# Altium schematic sheet Sheet1.SchDoc
size A
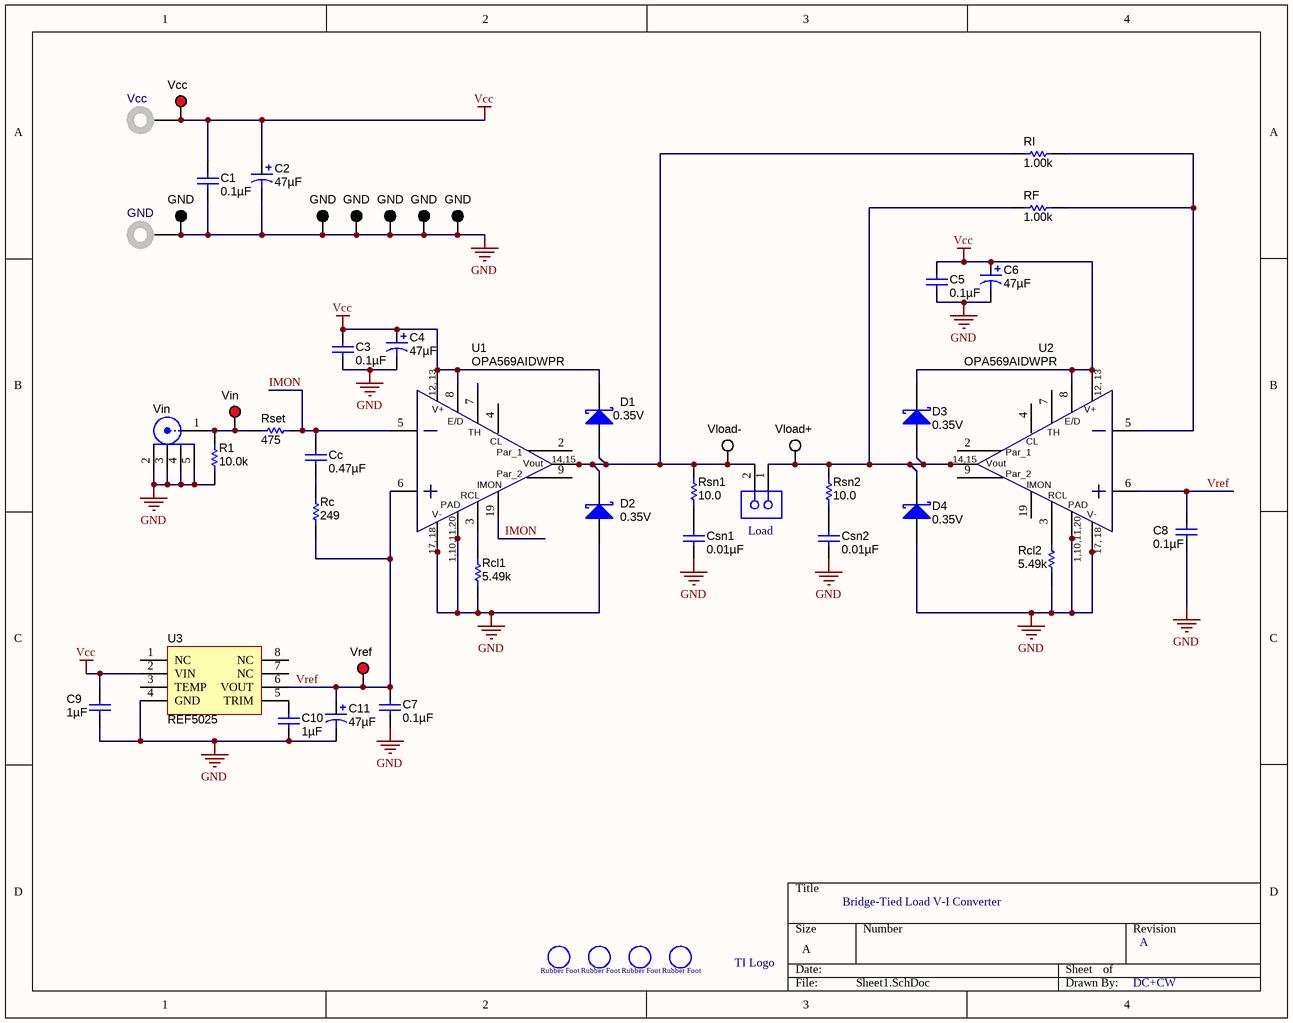
[diagram p0: Sheet1.SchDoc]

## Parts
C1  ValueDisplayed: 0.1µF  [1206]  (hidden comment: 12065C104JAT2A)
C2  ValueDisplayed: 47µF  [7343-31]  (hidden comment: 293D476X0016D2TE3)
C3  ValueDisplayed: 0.1µF  [1206]  (hidden comment: 12065C104JAT2A)
C4  ValueDisplayed: 47µF  [7343-31]  (hidden comment: 293D476X0016D2TE3)
C5  ValueDisplayed: 0.1µF  [1206]  (hidden comment: 12065C104JAT2A)
C6  ValueDisplayed: 47µF  [7343-31]  (hidden comment: 293D476X0016D2TE3)
C7  ValueDisplayed: 0.1µF  [1206]  (hidden comment: 12065C104JAT2A)
C8  ValueDisplayed: 0.1µF  [1206]  (hidden comment: 12065C104JAT2A)
C9  ValueDisplayed: 1µF  [0603]  (hidden comment: GRM188R71E105KA12D)
C10  ValueDisplayed: 1µF  [0603]  (hidden comment: GRM188R71E105KA12D)
C11  ValueDisplayed: 47µF  [7343-31]  (hidden comment: 293D476X0016D2TE3)
Cc  ValueDisplayed: 0.47µF  [1206]  (hidden comment: C3216X7R2A474K)
Csn1  ValueDisplayed: 0.01µF  [0603]  (hidden comment: C0603C103J5RACTU)
Csn2  ValueDisplayed: 0.01µF  [0603]  (hidden comment: C0603C103J5RACTU)
D1  value 0.35V  [SMC]  (hidden comment: 30BQ015TRPBF)
D2  value 0.35V  [SMC]  (hidden comment: 30BQ015TRPBF)
D3  value 0.35V  [SMC]  (hidden comment: 30BQ015TRPBF)
D4  value 0.35V  [SMC]  (hidden comment: 30BQ015TRPBF)
F1  (no value)  [Rubber_Foot]
F2  (no value)  [Rubber_Foot]
F3  (no value)  [Rubber_Foot]
F4  (no value)  [Rubber_Foot]
GND  (no value)  [Keystone_575-4]
Load  (no value)  [PhoenixContact_1715721]
R1  value 10.0k  [0603]  (hidden comment: RC0603FR-0710KL)
Rc  value 249  [0603]  (hidden comment: RC0603FR-07249RL)
Rcl1  value 5.49k  [0603]  (hidden comment: RC0603FR-075K49L)
Rcl2  value 5.49k  [0603]  (hidden comment: RC0603FR-075K49L)
RF  value 1.00k  [0603]  (hidden comment: RC0603FR-071KL)
RI  value 1.00k  [0603]  (hidden comment: RC0603FR-071KL)
Rset  value 475  [0603]  (hidden comment: RC0603FR-07475RL)
Rsn1  value 10.0  [0603]  (hidden comment: CRCW060310R0FKEA)
Rsn2  value 10.0  [0603]  (hidden comment: CRCW060310R0FKEA)
TI1  Texas Instruments logo  [TI LOGO]  (value not drawn)  (no BOM)
TP1  Vcc  [Keystone5000]
TP2  GND  [Keystone5001]
TP3  GND  [Keystone5001]
TP4  GND  [Keystone5001]
TP5  GND  [Keystone5001]
TP6  GND  [Keystone5001]
TP7  GND  [Keystone5001]
TP9  Vin  [Keystone5000]
TP10  Vload-  [Keystone5002]
TP11  Vload+  [Keystone5002]
TP13  Vref  [Keystone5000]
U1  OPA569AIDWPR  [SOIC-20-PWP (DWP)]
U2  OPA569AIDWPR  [SOIC-20-PWP (DWP)]
U3  REF5025  [M08A_M]
Vcc  (no value)  [Keystone_575-4]
Vin  (no value)  [Johnson_142-0701-20x]

## Nets
GND: C1.2 C2.2(-) C3.2 C4.2(-) C5.2 C6.2(-) C7.2 C8.2 C9.2 C10.2 C11.2(-) Csn1.2 Csn2.2 D2.2(A) D4.2(A) GND.1 R1.1 Rcl1.1 Rcl2.1 TP2.1 TP3.1 TP4.1 TP5.1 TP6.1 TP7.1 U1.1(PAD) U1.10(PAD) U1.11(PAD) U1.17(V-) U1.18(V-) U1.20(PAD) U1.21(PAD) U2.1(PAD) U2.10(PAD) U2.11(PAD) U2.17(V-) U2.18(V-) U2.20(PAD) U2.21(PAD) U3.4(GND) Vin.2 Vin.3 Vin.4 Vin.5
Vcc: C1.1 C2.1(+) C3.1 C4.1(+) C5.1 C6.1(+) C9.1 D1.1(K) D3.1(K) TP1.1 U1.8(E/~{D}) U1.12(V+) U1.13(V+) U2.8(E/~{D}) U2.12(V+) U2.13(V+) U3.2(VIN) Vcc.1
IMON: Cc.1 Rset.2 U1.5(IN-) U1.19(Imon)
Vref: C7.1 C8.1 C11.1(+) Rc.1 TP13.1 U1.6(IN+) U2.6(IN+) U3.6(VOUT)
NetC10_1: C10.1 U3.5(TRIM)
NetCc_2: Cc.2 Rc.2
NetCsn1_1: Csn1.1 Rsn1.1
NetCsn2_1: Csn2.1 Rsn2.1
NetD1_2: D1.2(A) D2.1(K) Load.2 RI.2 Rsn1.2 TP10.1 U1.14(Vo) U1.15(Vo)
NetD3_2: D3.2(A) D4.1(K) Load.1 RF.2 Rsn2.2 TP11.1 U2.14(Vo) U2.15(Vo)
NetR1_2: R1.2 Rset.1 TP9.1 Vin.1
NetRcl1_2: Rcl1.2 U1.3(RCL)
NetRcl2_2: Rcl2.2 U2.3(RCL)
NetRF_1: RF.1 RI.1 U2.5(IN-)

Not connected (* = marked no-connect by the designer): U1 2(Par_1) 4(CL) 7(TH) 9(Par_2) 16(NC); U2 2(Par_1) 4(CL) 7(TH) 9(Par_2) 16(NC) 19(Imon); U3 1(NC) 3(TEMP) 7(NC) 8(NC)

## Notes on the sheet
- Bridge-Tied Load V-I Converter
- A
- DC+CW
- (in symbol OPA569) 12, 13; E/D; 14,15; Vout; IMON; 17, 18; 1,10,11,20
- (in symbol SJ61A1) Rubber Foot
- (in symbol TI LOGO) TI Logo

## Library data of the parts
C1 C3 C5 C7 C8 = 12065C104JAT2A: CAP, CERM, 0.1uF, 50V, +/-5%, X7R, 1206; Manufacturer: AVX; Polarized: N; CompType: Capacitor; U/M: EA; Cap_F: 0.0000001; Tolerance_%: 5; ESR_Ohm: 0.037; Value1: 0.037 ohm; VDC_V: 50; TaMin_C: -55; TaMax_C: 125; SymbolVersion: 2008-07-09; Value: 0.1uF; PartNumber: 12065C104JAT2A; PackageReference: 1206; RoHS: Y; Value2: 50V; MountType: SMT; Technology: Ceramic; TempCo: X7R; Cap_Case: 1206; Published: 2008-06-19; Publisher: Texas Instruments; LatestRevisionDate: 2012-04-11; LatestRevisionNote: Changed publisher; ComponentLink1Description: Datasheet link; ComponentLink1URL: http://www.avx.com/docs/masterpubs/smccp.pdf; Alternate PartNumber: -; Alternate Manufacturer: -; Supplier 1: Digi-Key; Supplier Part Number 1: 478-3797-1-ND; Supplier 2: Farnell; Supplier Part Number 2: 4765813; Supplier 3: Newark; Supplier Part Number 3: 96M1508
C2 C4 C6 C11 = 293D476X0016D2TE3: CAP, TANT, 47uF, 16V, +/-20%, 0.7 ohm, 7343-31 SMD; Manufacturer: Vishay-Sprague; Polarized: Y; CompType: Capacitor; U/M: EA; Cap_F: 0.000047; Tolerance_%: 20; Value1: 0.7 ohm; VDC_V: 16; ESR_Ohm: 0.7; IRMS_A: 0.46; TaMin_C: -55; TaMax_C: 125; Cap_Case: D; SymbolVersion: 2008-07-09; Value: 47uF; PartNumber: 293D476X0016D2TE3; PackageReference: 7343-31; RoHS: Y; Value2: 16V; MountType: SMT; Technology: TA; Series: 293D; Published: 2008-06-19; Publisher: Texas Instruments; LatestRevisionDate: 2012-04-11; LatestRevisionNote: Changed Publisher; ComponentLink1Description: Datasheet link; ComponentLink1URL: http://www.vishay.com/docs/40002/293d.pdf; Alternate PartNumber: -; Alternate Manufacturer: -; Supplier 1: Digi-Key; Supplier Part Number 1: 718-1086-1-ND; Supplier 2: Farnell; Supplier Part Number 2: 9304282; Supplier 3: Newark; Supplier Part Number 3: 09K6624
C9 C10 = GRM188R71E105KA12D: CAP, CERM, 1uF, 25V, +/-10%, X7R, 0603; Manufacturer: MuRata; Polarized: N; CompType: Capacitor; U/M: EA; Cap_F: 0.000001; Tolerance_%: 10; VDC_V: 25; TaMin_C: -55; TaMax_C: 125; SymbolVersion: 2008-07-09; Value: 1uF; PartNumber: GRM188R71E105KA12D; PackageReference: 0603; RoHS: Y; Value1: ?; Value2: 25V; MountType: SMT; Technology: Ceramic; TempCo: X7R; Cap_Case: 0603; Published: 2008-06-19; Publisher: Texas Instruments; LatestRevisionDate: 2012-04-11; LatestRevisionNote: Changed publisher; ComponentLink1Description: Datasheet link; ComponentLink1URL: http://search.murata.co.jp/Ceramy/PnsearchViewAction.do?HnOFG=ON&HnNFG=ON&SEL_CNT=50&sLang=en&sKey=GRM188R71E105KA12D&x=9&y=9&search=startwith; Alternate PartNumber: -; Alternate Manufacturer: -; Supplier 1: Digi-Key; Supplier Part Number 1: 490-5307-1-ND
Cc = C3216X7R2A474K: CAP, CERM, 0.47uF, 100V, +/-10%, X7R, 1206; Manufacturer: TDK; Polarized: N; CompType: Capacitor; U/M: EA; Cap_F: 0.00000047; Tolerance_%: 10; ESR_Ohm: 0.0089; Value1: 0.0089 ohm; VDC_V: 100; TaMin_C: -55; TaMax_C: 125; SymbolVersion: 2008-07-09; Value: 0.47uF; PartNumber: C3216X7R2A474K; PackageReference: 1206; RoHS: Y; Value2: 100V; MountType: SMT; Technology: Ceramic; TempCo: X7R; Cap_Case: 1206; Published: 2008-06-19; Publisher: Texas Instruments; LatestRevisionDate: 2012-04-11; LatestRevisionNote: Changed publisher; ComponentLink1Description: Datasheet link; ComponentLink1URL: http://www.tdk.co.jp/tefe02/e412_c.pdf; Alternate PartNumber: -; Alternate Manufacturer: -; Supplier 1: Digi-Key; Supplier Part Number 1: 445-2284-1-ND; Supplier 2: Arrow; Supplier Part Number 2: C3216X7R2A474K
Csn1 Csn2 = C0603C103J5RACTU: CAP, CERM, 0.01uF, 50V, +/-5%, X7R, 0603; Manufacturer: Kemet; Polarized: N; CompType: Capacitor; U/M: EA; Cap_F: 0.00000001; Tolerance_%: 5; VDC_V: 50; TaMin_C: -55; TaMax_C: 125; SymbolVersion: 2008-07-09; Value: 0.01uF; PartNumber: C0603C103J5RACTU; PackageReference: 0603; RoHS: Y; Value1: ?; Value2: 50V; MountType: SMT; Technology: Ceramic; TempCo: X7R; Cap_Case: 0603; Published: 2008-06-19; Publisher: Texas Instruments; LatestRevisionDate: 2012-04-11; LatestRevisionNote: Changed publisher; ComponentLink1Description: Datasheet link; ComponentLink1URL: http://www.kemet.com/kemet/web/homepage/kechome.nsf/vapubfiles/F3102_Y5V.pdf/$file/F3102_Y5V.pdf; Alternate PartNumber: -; Alternate Manufacturer: -; Supplier 1: Digi-Key; Supplier Part Number 1: 399-1092-1-ND
D1-D4 = 30BQ015TRPBF: Diode, Schottky, 15V, 3A, SMC; Manufacturer: International Rectifier; U/M: EA; Vf_V: 0.35; Io_A: 3; Vr_V: 15; TJmax_C: 125; RJC_CperW: 12; CompType: Diode; SymbolVersion: 2008-12-08; PartNumber: 30BQ015TRPBF; PackageReference: SMC; Value1: 3A; Value2: 15V; MountType: SMT; Type: Schottky; RoHS: Y; Published: 2008-06-26; Publisher: Texas Instruments; LatestRevisionDate: 2012-01-10; LatestRevisionNote: Removed DigiKeyPartNumber parameter.; ComponentLink1Description: Datasheet link; ComponentLink1URL: http://www.vishay.com/docs/94178/94178.pdf; Alternate Manufacturer: -; Alternate PartNumber: -; Supplier 1: Digi-Key; Supplier Part Number 1: VS-30BQ015PBFCT-ND; Supplier 2: Farnell; Supplier Part Number 2: 8657050; Supplier 3: Arrow; Supplier Part Number 3: 30BQ015TRPBF
F1-F4 = SJ61A1: BUMPON CYLINDRICAL .312X.200 BLK; Manufacturer: 3M; CompType: Rubber Mounting Feet; SymbolCreator: use LDAP id; U/M: EA, IN, or GM; Supplier 1: Digi-Key; Supplier Part Number 1: SJ5746-0-ND; ComponentLink1Description: Datasheet Link; ComponentLink1URL: http://media.digikey.com/pdf/Data%20Sheets/3M%20PDFs/SJ61A1.pdf; MountType: Adhesive - Rubber; PackageReference: *; RoHS: N/A; SymbolVersion: 2012-11-20
GND Vcc = 575-4: Standard Banana Jack, Uninsulated, 5.5mm; Manufacturer: Keystone; CompType: Connector; U/M: EA; PartNumber: 575-4; RoHS: Y; PackageReference: Keystone_575-4; MountType: TH; ComponentLink1Description: Datasheet Link; ComponentLink1URL: http://www.keyelco.com/pdfs/M55p95.pdf; Publisher: National Semiconductor; LatestRevisionDate: 2012-03-04; LatestRevisionNote: Removed DigiKeyPartNumber parameter.; Alternate Manufacturer: -; Alternate PartNumber: -; Supplier 1: Digi-Key; Supplier Part Number 1: 575-4K-ND
Load = 1715721: Conn Term Block, 2POS, 5.08mm PCB; Manufacturer: Phoenix Contact; CompType: Terminal Block; U/M: EA; Value: 2x1; SymbolVersion: 2010-10-20; PartNumber: 1715721; RoHS: Y; PackageReference: PhoenixContact_1715721; MountType: TH; ComponentLink1Description: Datasheet Link; ComponentLink1URL: http://eshop.phoenixcontact.com/phoenix/pdf.do?UID=1715721&general=usen; Publisher: National Semiconductor; LatestRevisionDate: 2012-03-04; LatestRevisionNote: Removed DigiKeyPartNumber parameter.; Alternate Manufacturer: -; Alternate PartNumber: -; Supplier 1: Digi-Key; Supplier Part Number 1: 277-1263-ND
R1 = RC0603FR-0710KL: RES, 10.0k ohm, 1%, 0.1W, 0603; Manufacturer: Yageo America; CompType: Resistor; Res_ohm: 10000; Value_Code: 10k0; Tolerance_%: 1; Power_W: 0.1; VDC_V: 150; TempCo: 200 ppm/C; EIA_Code: E96; U/M: EA; SymbolVersion: 2009-05-29; PartNumber: RC0603FR-0710KL; PackageReference: 0603; RoHS: Y; Value1: 1%; Value2: 0.1W; MountType: SMT; Technology: Thick Film; Published: 2008-06-26; Publisher: Texas Instruments; LatestRevisionDate: 2012-04-20; LatestRevisionNote: Changed publisher; ComponentLink1Description: Datasheet link; ComponentLink1URL: http://www.yageo.com/pdf/Pu-RC0603_51_PbFree_L_2.pdf; Alternate PartNumber: -; Alternate Manufacturer: -; Supplier 1: Digi-Key; Supplier Part Number 1: 311-10.0KHRCT-ND
Rc = RC0603FR-07249RL: RES, 249 ohm, 1%, 0.1W, 0603; Manufacturer: Yageo America; CompType: Resistor; Value_Code: 249R; Tolerance_%: 1; Power_W: 0.1; VDC_V: 150; TempCo: 200 ppm/C; EIA_Code: E96; U/M: EA; SymbolVersion: 2009-05-29; PartNumber: RC0603FR-07249RL; PackageReference: 0603; RoHS: Y; Res_ohm: 249; Value1: 1%; Value2: 0.1W; MountType: SMT; Technology: Thick Film; Published: 2008-06-26; Publisher: Texas Instruments; LatestRevisionDate: 2012-04-20; LatestRevisionNote: Changed publisher; ComponentLink1Description: Datasheet link; ComponentLink1URL: http://www.yageo.com/pdf/Pu-RC0603_51_PbFree_L_2.pdf; Alternate PartNumber: -; Alternate Manufacturer: -; Supplier 1: Digi-Key; Supplier Part Number 1: 311-249HRCT-ND
Rcl1 Rcl2 = RC0603FR-075K49L: RES, 5.49k ohm, 1%, 0.1W, 0603; Manufacturer: Yageo America; CompType: Resistor; Res_ohm: 5490; Value_Code: 5k49; Tolerance_%: 1; Power_W: 0.1; VDC_V: 150; TempCo: 200 ppm/C; EIA_Code: E96; U/M: EA; SymbolVersion: 2009-05-29; PartNumber: RC0603FR-075K49L; PackageReference: 0603; RoHS: Y; Value1: 1%; Value2: 0.1W; MountType: SMT; Technology: Thick Film; Published: 2008-06-26; Publisher: Texas Instruments; LatestRevisionDate: 2012-04-20; LatestRevisionNote: Changed publisher; ComponentLink1Description: Datasheet link; ComponentLink1URL: http://www.yageo.com/pdf/Pu-RC0603_51_PbFree_L_2.pdf; Alternate PartNumber: -; Alternate Manufacturer: -; Supplier 1: Digi-Key; Supplier Part Number 1: 311-5.49KHRCT-ND
RF RI = RC0603FR-071KL: RES, 1.00k ohm, 1%, 0.1W, 0603; Manufacturer: Yageo America; CompType: Resistor; Res_ohm: 1000; Value_Code: 1k00; Tolerance_%: 1; Power_W: 0.1; VDC_V: 150; TempCo: 200 ppm/C; EIA_Code: E96; U/M: EA; SymbolVersion: 2009-05-29; PartNumber: RC0603FR-071KL; PackageReference: 0603; RoHS: Y; Value1: 1%; Value2: 0.1W; MountType: SMT; Technology: Thick Film; Published: 2008-06-26; Publisher: Texas Instruments; LatestRevisionDate: 2012-04-20; LatestRevisionNote: Changed publisher; ComponentLink1Description: Datasheet link; ComponentLink1URL: http://www.yageo.com/pdf/Pu-RC0603_51_PbFree_L_2.pdf; Alternate PartNumber: -; Alternate Manufacturer: -; Supplier 1: Digi-Key; Supplier Part Number 1: 311-1.00KHRCT-ND
Rset = RC0603FR-07475RL: RES, 475 ohm, 1%, 0.1W, 0603; Manufacturer: Yageo America; CompType: Resistor; Value_Code: 475R; Tolerance_%: 1; Power_W: 0.1; VDC_V: 150; TempCo: 200 ppm/C; EIA_Code: E96; U/M: EA; SymbolVersion: 2009-05-29; PartNumber: RC0603FR-07475RL; PackageReference: 0603; RoHS: Y; Res_ohm: 475; Value1: 1%; Value2: 0.1W; MountType: SMT; Technology: Thick Film; Published: 2008-06-26; Publisher: Texas Instruments; LatestRevisionDate: 2012-04-20; LatestRevisionNote: Changed publisher; ComponentLink1Description: Datasheet link; ComponentLink1URL: http://www.yageo.com/pdf/Pu-RC0603_51_PbFree_L_2.pdf; Alternate PartNumber: -; Alternate Manufacturer: -; Supplier 1: Digi-Key; Supplier Part Number 1: 311-475HRCT-ND
Rsn1 Rsn2 = CRCW060310R0FKEA: RES, 10.0 ohm, 1%, 0.1W, 0603; Manufacturer: Vishay-Dale; CompType: Resistor; Res_ohm: 10; Value_Code: 10R0; Tolerance_%: 1; Power_W: 0.1; VDC_V: 75; TempCo: 100 ppm/C; EIA_Code: E96; U/M: EA; SymbolVersion: 2009-05-29; PartNumber: CRCW060310R0FKEA; PackageReference: 0603; RoHS: Y; Value1: 1%; Value2: 0.1W; MountType: SMT; Technology: Thick Film; Published: 2008-06-26; Publisher: Texas Instruments; LatestRevisionDate: 2012-04-20; LatestRevisionNote: Changed publisher; ComponentLink1Description: Datasheet link; ComponentLink1URL: http://www.vishay.com/docs/20035/dcrcwe3.pdf; Alternate PartNumber: -; Alternate Manufacturer: -; Supplier 1: Digi-Key; Supplier Part Number 1: 541-10.0HCT-ND; Supplier 2: Farnell; Supplier Part Number 2: 1157184; Supplier 3: Newark; Supplier Part Number 3: 52K8073
TI1 = TI LOGO: TI BUG
TP1 TP9 TP13 = 5000: Test Point, TH, Miniature, Red; Manufacturer: Keystone; CompType: Test Point Loop; U/M: EA; RoHS: Y; DigiKeyPartNumber: 5000K-ND; Value: Red; SymbolVersion: 2008-04-04; PartNumber: 5000; PackageReference: Keystone5000; ComponentLink1Description: Datasheet Link; ComponentLink1URL: http://www.keyelco.com/pdfs/M55p51.pdf; MountType: TH; Publisher: National Semiconductor; LatestRevisionDate: 2012-03-04; LatestRevisionNote: Removed DigiKeyPartNumber parameter.; Alternate Manufacturer: -; Alternate PartNumber: -; Supplier 1: Digi-Key; Supplier Part Number 1: 5000K-ND
TP2-TP7 = 5001: Test Point, TH, Miniature, Black; Manufacturer: Keystone; CompType: Test Point Loop; U/M: EA; RoHS: Y; DigiKeyPartNumber: 5001K-ND; Value: Black; SymbolVersion: 2008-04-04; PartNumber: 5001; PackageReference: Keystone5001; ComponentLink1Description: Datasheet Link; ComponentLink1URL: http://www.keyelco.com/pdfs/M55p51.pdf; MountType: TH; Publisher: National Semiconductor; LatestRevisionDate: 2012-03-04; LatestRevisionNote: Removed DigiKeyPartNumber parameter.; Alternate Manufacturer: -; Alternate PartNumber: -; Supplier 1: Digi-Key; Supplier Part Number 1: 5001K-ND
TP10 TP11 = 5002: Test Point, TH, Miniature, White; Manufacturer: Keystone; CompType: Test Point Loop; U/M: EA; RoHS: Y; DigiKeyPartNumber: 5002K-ND; Value: White; SymbolVersion: 2008-04-04; PartNumber: 5002; PackageReference: Keystone5002; ComponentLink1Description: Datasheet Link; ComponentLink1URL: http://www.keyelco.com/pdfs/M55p51.pdf; MountType: TH; Publisher: National Semiconductor; LatestRevisionDate: 2012-03-04; LatestRevisionNote: Removed DigiKeyPartNumber parameter.; Alternate Manufacturer: -; Alternate PartNumber: -; Supplier 1: Digi-Key; Supplier Part Number 1: 5002K-ND; Supplier 2: Newark; Supplier Part Number 2: 82H9632
U1 U2 = OPA569: IC OPAMP GP R-R 1.2MHZ 20SOIC; Manufacturer: Texas Instruments; SymbolCreator: Use LDAP id; CompType: Op-Amp IC; U/M: EA, IN, or GM; SymbolVersion: 2012-10-24; RoHS: Y; PartNumber: OPA569AIDWPR; PackageReference: 20-SOIC; ComponentLink1Description: Datasheet Link; ComponentLink1URL: http://www.ti.com/lit/ds/symlink/opa569.pdf; Supplier Part Number 1: 296-26292-1-ND; PackageDescription: 20-SO PowerPad
  U1: Supplier 1: Digi-Key
  U2: Supplier 1: Digikey
U3 = REF5025: IC VREF SERIES PREC 2.5V 8-SOIC; Manufacturer: Texas Instruments; SymbolVersion: use current date i.e. 2008-05-20; SymbolCreator: Use LDAP id; CompType: PMIC, Voltage Reference; U/M: EA, IN, or GM; MountType: SMT; RoHS: Y; PartNumber: 8-SOIC; PackageReference: eg:  0603, used in PnP report; ComponentLink1Description: Datasheet Link; ComponentLink1URL: http://www.ti.com/lit/ds/symlink/ref5025-ep.pdf; Alternate PartNumber: -; Alternate Manufacturer: -; Supplier Part Number 1: 296-27641-1-ND
Vin = 142-0701-201: Connector, TH, SMA; Manufacturer: Emerson Network Power; U/M: EA; PartNumber: 142-0701-201; CompType: Connector; RoHS: Y; PackageReference: SMA; MountType: TH; ComponentLink1Description: Datasheet Link; ComponentLink1URL: https://emersonconnectivity.com/OA_MEDIA/specs/pi-1420701201.pdf; Publisher: National Semiconductor; LatestRevisionDate: 2012-03-04; LatestRevisionNote: Removed DigiKeyPartNumber parameter.; Alternate Manufacturer: -; Alternate PartNumber: -; Supplier 1: Digi-Key; Supplier Part Number 1: J500-ND